# EAGLE design Xonik Waveshaper v2.3 (EAGLE 9.6.2)
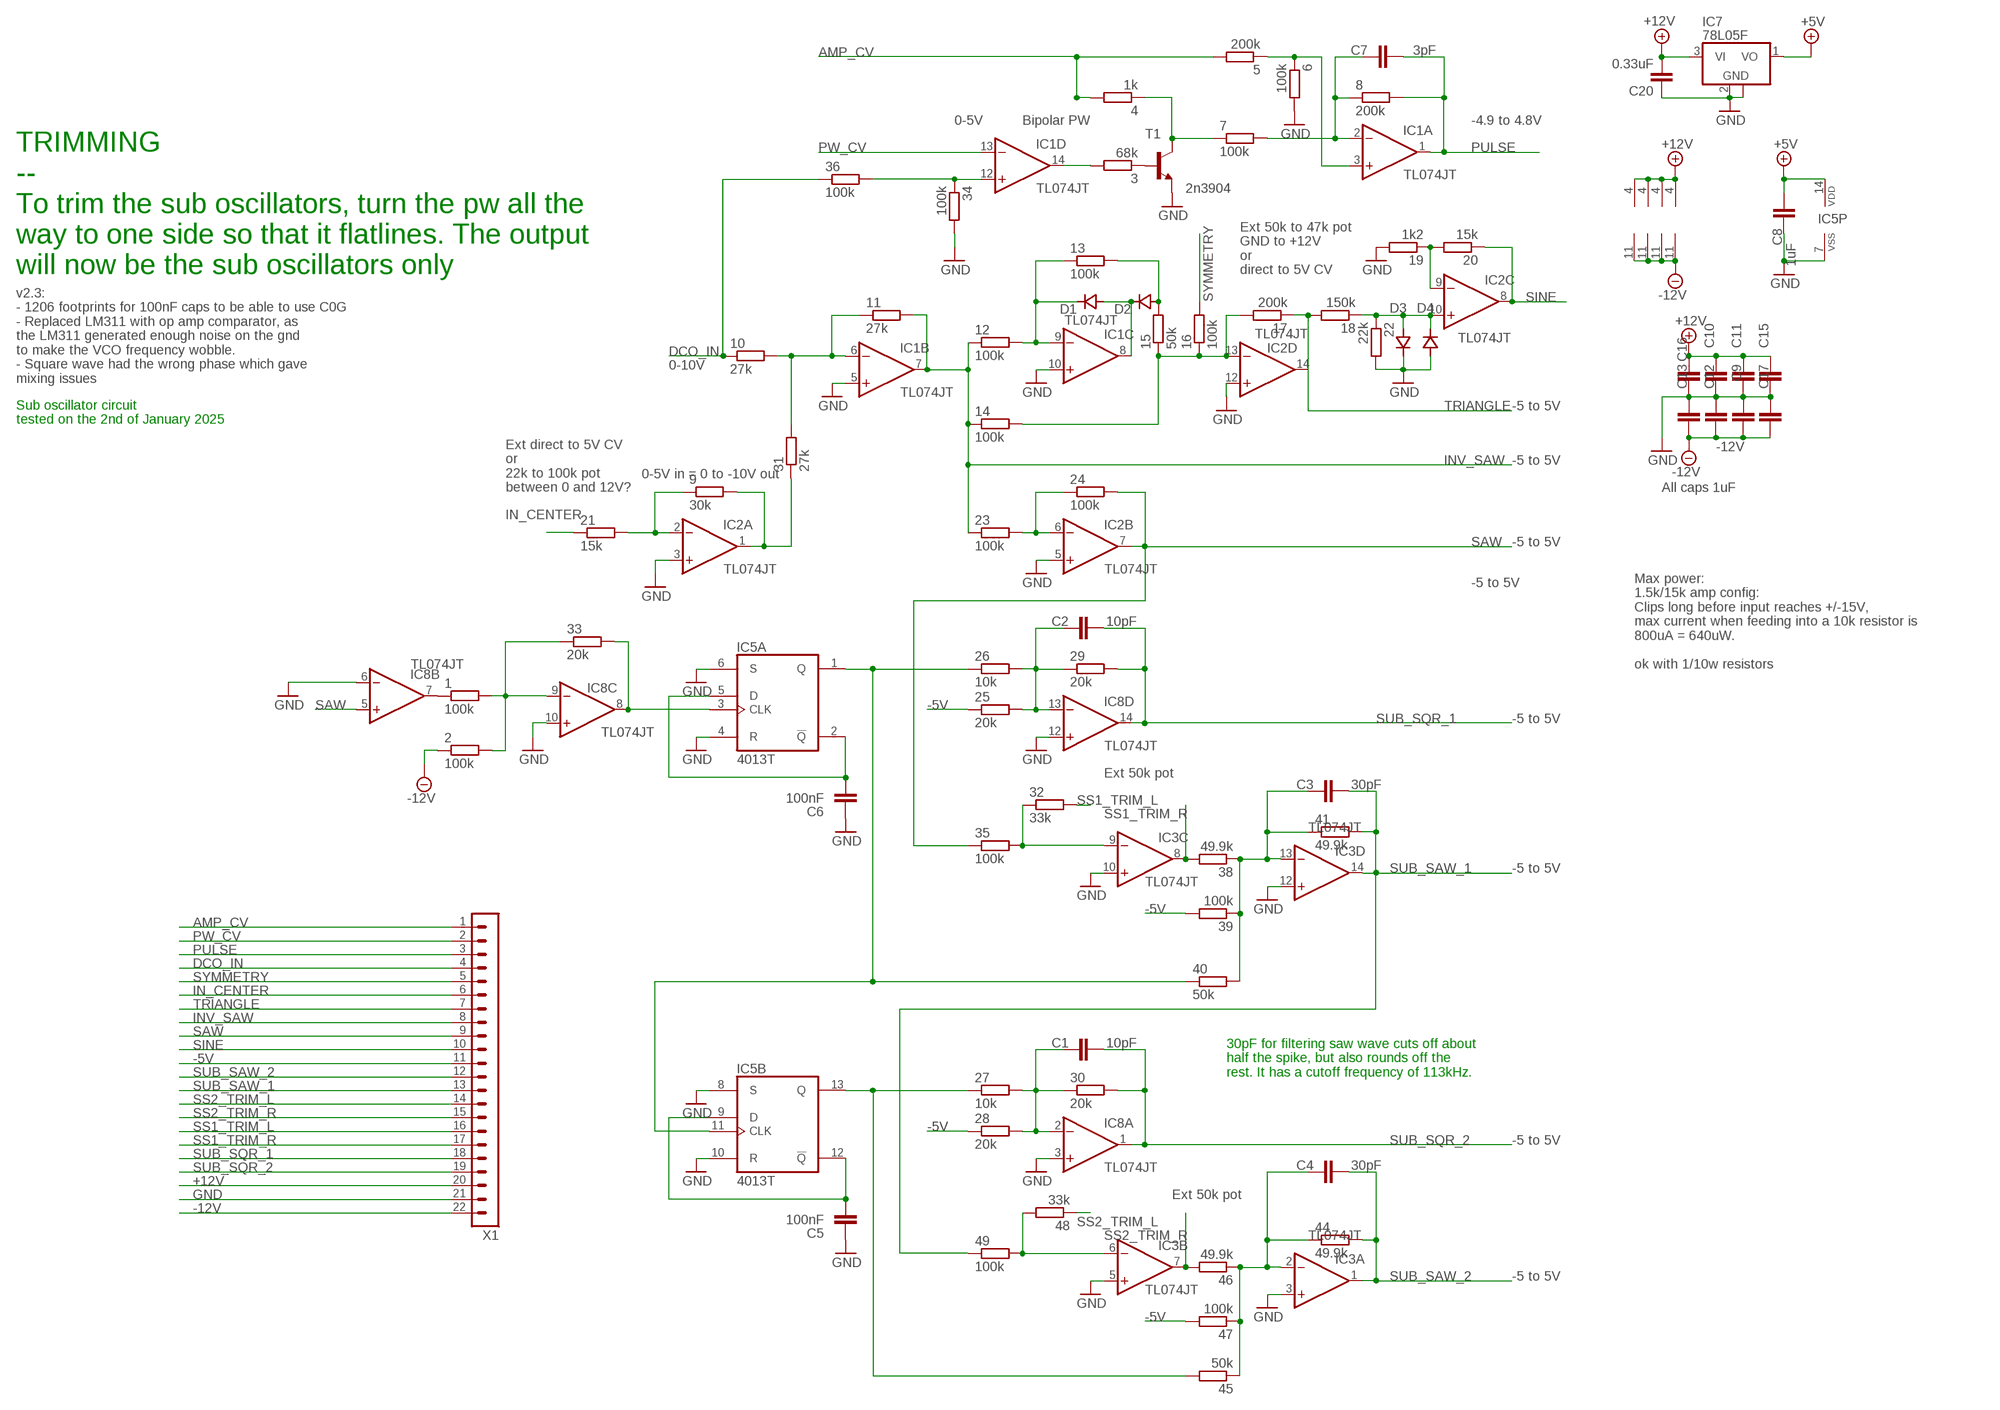
[diagram p0: schematic, sheet 1]

## Parts
1  100k  R-EU_R0603  [R0603]
2  100k  R-EU_R0603  [R0603]
3  68k  R-EU_R0603  [R0603]
4  1k  R-EU_R0603  [R0603]
5  200k  R-EU_R0603  [R0603]
6  100k  R-EU_R0603  [R0603]
7  100k  R-EU_R0603  [R0603]
8  200k  R-EU_R0603  [R0603]
9  30k  R-EU_R0603  [R0603]
10  27k  R-EU_R0603  [R0603]
11  27k  R-EU_R0603  [R0603]
12  100k  R-EU_R0603  [R0603]
13  100k  R-EU_R0402  [R0402]
14  100k  R-EU_R0603  [R0603]
15  50k  R-EU_R0603  [R0603]
16  100k  R-EU_R0603  [R0603]
17  200k  R-EU_R0603  [R0603]
18  150k  R-EU_R0603  [R0603]
19  1k2  R-EU_R0603  [R0603]
20  15k  R-EU_R0603  [R0603]
21  15k  R-EU_R0603  [R0603]
22  22k  R-EU_R0603  [R0603]
23  100k  R-EU_R0603  [R0603]
24  100k  R-EU_R0402  [R0402]
25  20k  R-EU_R0603  [R0603]
26  10k  R-EU_R0603  [R0603]
27  10k  R-EU_R0603  [R0603]
28  20k  R-EU_R0603  [R0603]
29  20k  R-EU_R0603  [R0603]
30  20k  R-EU_R0603  [R0603]
31  27k  R-EU_R0603  [R0603]
32  33k  R-EU_R0603  [R0603]
33  20k  R-EU_R0603  [R0603]
34  100k  R-EU_R0402  [R0402]
35  100k  R-EU_R0603  [R0603]
36  100k  R-EU_R0402  [R0402]
38  49.9k  R-EU_R0603  [R0603]
39  100k  R-EU_R0603  [R0603]
40  50k  R-EU_R0603  [R0603]
41  49.9k  R-EU_R0603  [R0603]
44  49.9k  R-EU_R0603  [R0603]
45  50k  R-EU_R0603  [R0603]
46  49.9k  R-EU_R0603  [R0603]
47  100k  R-EU_R0603  [R0603]
48  33k  R-EU_R0603  [R0603]
49  100k  R-EU_R0603  [R0603]
C1  10pF  C-EU-J0603  [C0603-J]
C2  10pF  C-EU-J0603  [C0603-J]
C3  30pF  C-EU-J0603  [C0603-J]
C4  30pF  C-EU-J0603  [C0603-J]
C5  100nF  C-EUC1206  [C1206]
C6  100nF  C-EUC1206  [C1206]
C7  3pF  C-EU-J0603  [C0603-J]
C8  1uF  C-EU-J0402  [C0402-J]
C9  1uF  C-EU-J0402  [C0402-J]
C10  1uF  C-EU-J0402  [C0402-J]
C11  1uF  C-EU-J0402  [C0402-J]
C12  1uF  C-EU-J0402  [C0402-J]
C13  1uF  C-EU-J0402  [C0402-J]
C15  1uF  C-EU-J0402  [C0402-J]
C16  1uF  C-EU-J0402  [C0402-J]
C17  1uF  C-EU-J0402  [C0402-J]
C20  0.33uF  C-EU-J0603  [C0603-J]
D1  1N41480805  [D0805-J]
D2  1N41480805  [D0805-J]
D3  1N41480805  [D0805-J]
D4  1N41480805  [D0805-J]
IC1  TL074JT  [TSSOP14J]
IC2  TL074JT  [TSSOP14J]
IC3  TL074JT  [TSSOP14J]
IC5  4013T  [TSSOP14J]
IC7  78L05F  [SOT89]
IC8  TL074JT  [TSSOP14J]
T1  2n3904  MMBT3904LT1-NPN-SOT23-BEC  [SOT23-BEC]
X1  MA22-1JN  [MA22N-1J]

## Nets
+5V: C8.2 IC5.14(P:VDD) IC7.1(VO)
+12V: C10.2 C11.2 C15.2 C16.2 C20.2 IC1.4(P:V+) IC2.4(P:V+) IC3.4(P:V+) IC7.3(VI) IC8.4(P:V+) X1.20
-5V: 25.1 28.1 39.2 47.2 X1.11
-12V: 2.1 C9.1 C12.1 C13.1 C17.1 IC1.11(P:V-) IC2.11(P:V-) IC3.11(P:V-) IC8.11(P:V-) X1.22
AMP_CV: 4.2 5.2 X1.1
DCO_IN: 10.1 36.1 X1.4
GND: 6.2 19.2 22.2 34.2 C5.1 C6.1 C8.1 C9.2 C10.1 C11.1 C12.2 C13.2 C15.1 C16.1 C17.2 C20.1 D3.C D4.A IC1.5(B:+IN) IC1.10(C:+IN) IC2.3(A:+IN) IC2.5(B:+IN) IC2.12(D:+IN) IC3.3(A:+IN) IC3.5(B:+IN) IC3.10(C:+IN) IC3.12(D:+IN) IC5.4(A:R) IC5.6(A:S) IC5.7(P:VSS) IC5.8(B:S) IC5.10(B:R) IC7.2(GND) IC7.2@1(GND) IC8.3(A:+IN) IC8.6(B:-IN) IC8.10(C:+IN) IC8.12(D:+IN) T1.E X1.21
IN_CENTER: 21.1 X1.6
INV_SAW: 11.2 12.1 14.1 23.1 IC1.7(B:OUT) X1.8
N$1: 9.1 21.2 IC2.2(A:-IN)
N$2: 3.2 IC1.14(D:OUT)
N$3: 3.1 T1.B
N$4: 4.1 7.1 T1.C
N$5: 5.1 6.1 IC1.3(A:+IN)
N$6: 7.2 8.1 C7.1 IC1.2(A:-IN)
N$7: 1.1 IC8.7(B:OUT)
N$8: 34.1 36.2 IC1.12(D:+IN)
N$9: 1.2 2.2 33.1 IC8.9(C:-IN)
N$10: 10.2 11.1 31.2 IC1.6(B:-IN)
N$11: 12.2 13.1 D1.C IC1.9(C:-IN)
N$12: D1.A D2.C IC1.8(C:OUT)
N$13: 13.2 15.2 D2.A
N$14: 14.2 15.1 16.1 17.2 IC2.13(D:-IN)
N$15: 23.2 24.1 IC2.6(B:-IN)
N$17: 33.2 IC5.3(A:CLK) IC8.8(C:OUT)
N$19: 25.2 26.2 29.1 C2.1 IC8.13(D:-IN)
N$21: 48.2 49.2 IC3.6(B:-IN)
N$22: 27.2 28.2 30.1 C1.1 IC8.2(A:-IN)
N$24: 32.1 35.2 IC3.9(C:-IN)
N$26: 38.1 39.1 40.2 41.1 C3.1 IC3.13(D:-IN)
N$29: 44.1 45.1 46.1 47.1 C4.1 IC3.2(A:-IN)
N$31: C6.2 IC5.2(A:!Q) IC5.5(A:D)
N$32: 26.1 40.1 IC5.1(A:Q) IC5.11(B:CLK)
N$34: C5.2 IC5.9(B:D) IC5.12(B:!Q)
N$35: 27.1 45.2 IC5.13(B:Q)
N$36: 19.1 20.2 IC2.9(C:-IN)
N$39: 18.1 22.1 D3.A D4.C IC2.10(C:+IN)
N$42: 9.2 31.1 IC2.1(A:OUT)
PULSE: 8.2 C7.2 IC1.1(A:OUT) X1.3
PW_CV: IC1.13(D:-IN) X1.2
SAW: 24.2 35.1 IC2.7(B:OUT) IC8.5(B:+IN) X1.9
SINE: 20.1 IC2.8(C:OUT) X1.10
SS1_TRIM_L: 32.2 X1.16
SS1_TRIM_R: 38.2 IC3.8(C:OUT) X1.17
SS2_TRIM_L: 48.1 X1.14
SS2_TRIM_R: 46.2 IC3.7(B:OUT) X1.15
SUB_SAW_1: 41.2 49.1 C3.2 IC3.14(D:OUT) X1.13
SUB_SAW_2: 44.2 C4.2 IC3.1(A:OUT) X1.12
SUB_SQR_1: 29.2 C2.2 IC8.14(D:OUT) X1.18
SUB_SQR_2: 30.2 C1.2 IC8.1(A:OUT) X1.19
SYMMETRY: 16.2 X1.5
TRIANGLE: 17.1 18.2 IC2.14(D:OUT) X1.7

## Notes on the sheet
- 0-5V | Bipolar PW | -4.9 to 4.8V
- TRIMMING
  --
  To trim the sub oscillators, turn the pw all the 
  way to one side so that it flatlines. The output 
  will now be the sub oscillators only
- Ext 50k to 47k pot 
  GND to +12V
  or
  direct to 5V CV
- 0-10V
- v2.3:
  - 1206 footprints for 100nF caps to be able to use C0G
  - Replaced LM311 with op amp comparator, as 
  the LM311 generated enough noise on the gnd
  to make the VCO frequency wobble.
  - Square wave had the wrong phase which gave
  mixing issues
- -5 to 5V
- Sub oscillator circuit
  tested on the 2nd of January 2025
- -5 to 5V
- 0-5V in = 0 to -10V out
- Ext direct to 5V CV
  or 
  22k to 100k pot
  between 0 and 12V?
- All caps 1uF
- -5 to 5V
- -5 to 5V
- Max power:
  1.5k/15k amp config:
  Clips long before input reaches +/-15V,
  max current when feeding into a 10k resistor is
  800uA = 640uW. 
  
  ok with 1/10w resistors
- -5 to 5V
- Ext 50k pot
- -5 to 5V
- 30pF for filtering saw wave cuts off about
  half the spike, but also rounds off the
  rest. It has a cutoff frequency of 113kHz.
- -5 to 5V
- Ext 50k pot
- -5 to 5V

## Library data of the parts
1-36 38-41 44-49 = rcl:R-EU_: RESISTOR, European symbol; SPICEPREFIX: R
C1-C4 C7-C13 C15-C17 C20 = joakim:C-EU-J: CAPACITOR, European symbol
C5 C6 = rcl:C-EU: CAPACITOR, European symbol; SPICEPREFIX: C
D1-D4 = joakim:1N4148: DIODE high speed (Philips)
IC1-IC3 IC8 = joakim:TL074J: OP AMP
IC5 = joakim:4013: Dual D FLIP FLOP, set/reset
IC7 = linear:78L*: POSITOIV-VOLTAGE REGULATORS Output up to 100 mA Source: Datasheet <http://focus.ti.com/lit/ds/symlink/ua78l05.pdf>
T1 = transistor-neu-to92:*-NPN-: NPN Transistror
X1 = joakim:MA22-1J: PIN HEADER

## Board
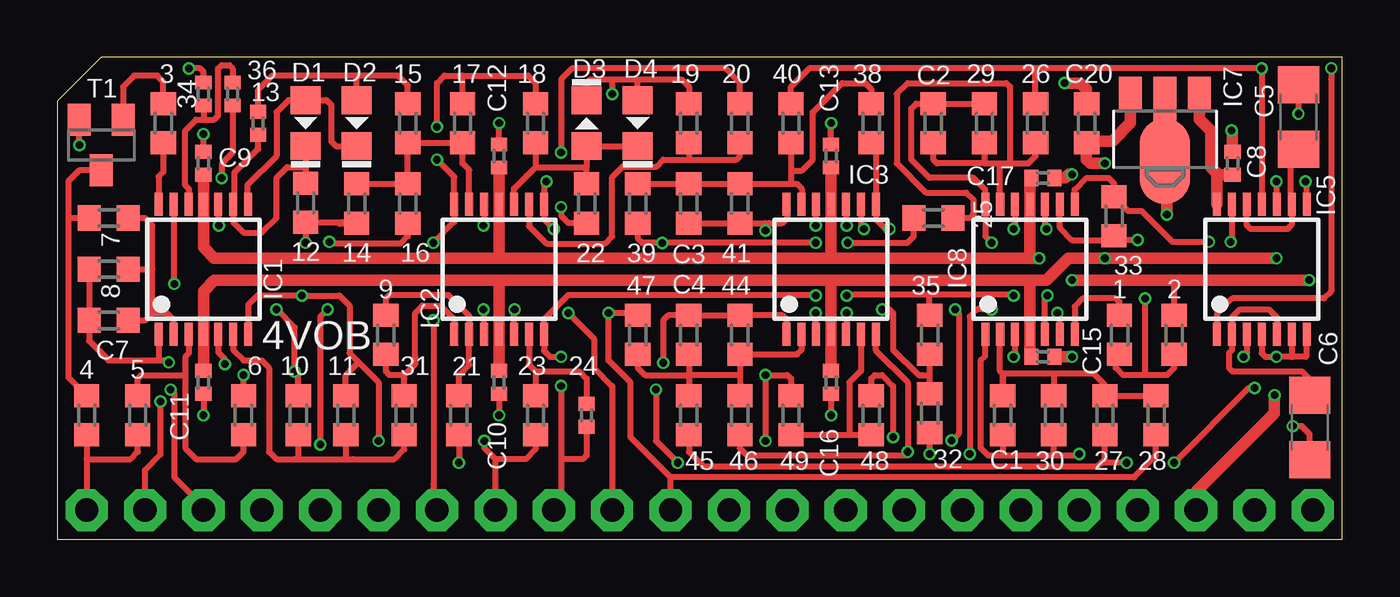
[diagram p1: board, top side]
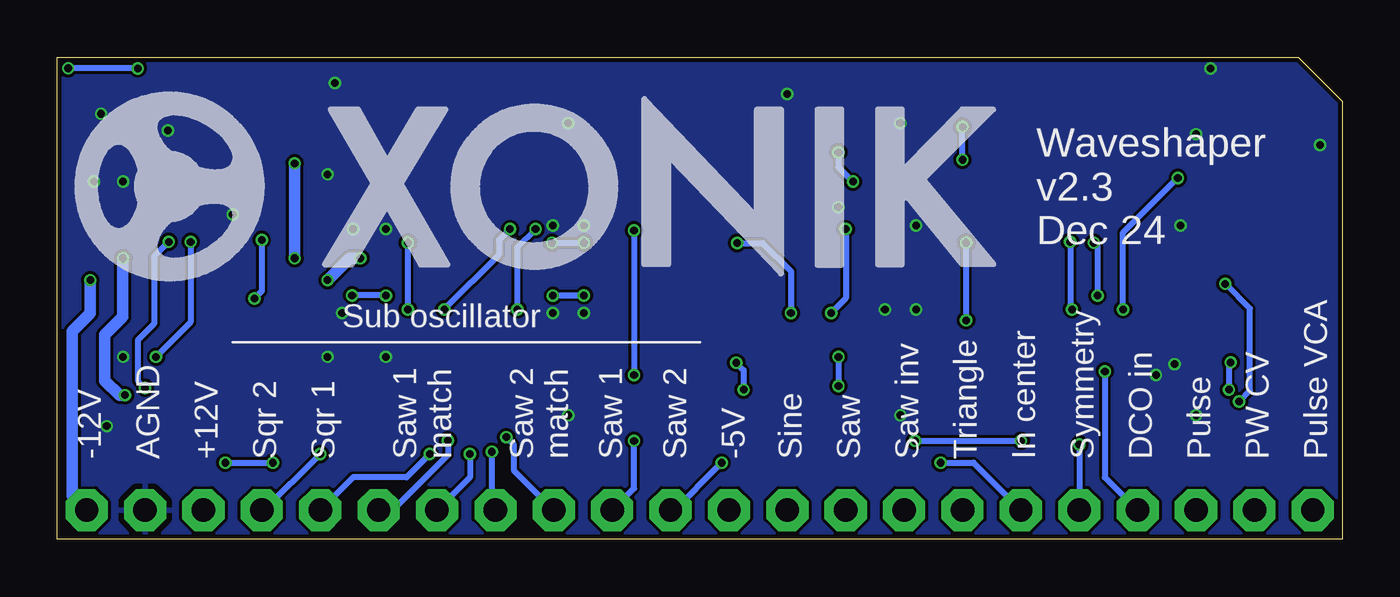
[diagram p2: board, bottom side, seen from below]

Size 55.88 x 20.95 mm. Coordinates in mm from the lower left corner, seen from the top.
Outline: 0,0 55.88,0 55.88,20.95 1.91,20.95 0,19.05 0,0
Copper layers (1*16): Top 0.035mm / dielectric 1.6mm / Bottom 0.035mm
Design rules "jlcpcb-2layers *": minimum track width 5mil, minimum drill 0.3mm, track to track 5mil, track to pad 5mil, pad to pad 5mil, via to via 5mil, smd to smd 5mil, copper to edge 0.2mm, drill to drill 6mil, minimum pad ring 10mil, minimum via ring 4mil, stop-mask expansion 4mil, vias tented up to drill 0mil, thermal gap 10mil

### Footprints (pad centres in the part's own frame; a part is rotated, then mirrored left to right if it is on the bottom)
R0603 = smd 1 x 1.1: 1 -0.85,0; 2 0.85,0
R0402 = smd 0.6 x 0.7: 1 -0.5,0; 2 0.5,0
C0603-J = smd 1 x 1.1: 1 -0.85,0; 2 0.85,0
C1206 = smd 1.6 x 1.8: 1 -1.4,0; 2 1.4,0
C0402-J = smd 0.6 x 0.7: 1 -0.5,0; 2 0.5,0
D0805-J = smd 1.2 x 1.3: A 1,0; C -1,0
TSSOP14J = smd 0.35 x 1: 1 -1.95,-2.825; 2 -1.3,-2.825; 3 -0.65,-2.825; 4 0,-2.825; 5 0.65,-2.825; 6 1.3,-2.825; 7 1.95,-2.825; 8 1.95,2.825; 9 1.3,2.825; 10 0.65,2.825; 11 0,2.825; 12 -0.65,2.825; 13 -1.3,2.825; 14 -1.95,2.825
SOT89 = smd 1 x 1.5: 1 -1.499,-1.981; 3 1.499,-1.981 | smd 1 x 2: 2 0,-1.727 | smd 2.2 x 3.7: 2@1 0,0.94
SOT23-BEC = smd 1 x 1.4: B -0.95,-1.1; C 0,1.1; E 0.95,-1.1
MA22N-1J = drill 1.016 octagon: 1 -26.67,0; 2 -24.13,0; 3 -21.59,0; 4 -19.05,0; 5 -16.51,0; 6 -13.97,0; 7 -11.43,0; 8 -8.89,0; 9 -6.35,0; 10 -3.81,0; 11 -1.27,0; 12 1.27,0; 13 3.81,0; 14 6.35,0; 15 8.89,0; 16 11.43,0; 17 13.97,0; 18 16.51,0; 19 19.05,0; 20 21.59,0; 21 24.13,0; 22 26.67,0

### Placement (x,y rotation side)
1  46.2,8.89 270 top
2  48.58,8.89 270 top
3  4.6,18.1 270 top
4  1.27,5.4 270 top
5  3.49,5.4 270 top
6  8.1,5.4 90 top
7  2.22,13.97 0 top
8  2.22,11.75 180 top
9  14.29,8.89 270 top
10  10.48,5.4 270 top
11  12.54,5.4 90 top
12  10.79,14.64 90 top
13  8.73,18.1 90 top
14  13.02,14.61 90 top
15  15.24,18.1 90 top
16  15.24,14.61 270 top
17  17.62,18.1 270 top
18  20.8,18.1 90 top
19  27.46,18.1 90 top
20  29.69,18.1 270 top
21  17.46,5.4 90 top
22  23.02,14.61 270 top
23  20.8,5.4 90 top
24  23.02,5.4 270 top
25  38.1,13.97 0 top
26  42.55,18.1 270 top
27  45.56,5.4 90 top
28  47.78,5.4 90 top
29  40.32,18.1 90 top
30  43.34,5.4 270 top
31  15.08,5.4 270 top
32  37.94,5.48 270 top
33  45.96,14.05 90 top
34  6.35,19.37 90 top
35  37.94,8.89 270 top
36  7.62,19.37 90 top
38  35.4,18.1 270 top
39  25.24,14.61 270 top
40  31.91,18.1 270 top
41  29.69,14.61 270 top
44  29.69,8.89 90 top
45  27.46,5.4 270 top
46  29.69,5.4 270 top
47  25.24,8.89 90 top
48  35.4,5.4 270 top
49  31.91,5.4 270 top
C1  41.12,5.4 270 top
C2  38.1,18.1 90 top
C3  27.46,14.61 270 top
C4  27.46,8.89 90 top
C5  53.98,18.36 270 top
C6  54.48,4.86 90 top
C7  2.22,9.53 180 top
C8  51.12,16.35 270 top
C9  6.35,16.35 90 top
C10  19.21,6.83 90 top
C11  6.35,6.83 90 top
C12  19.21,16.67 90 top
C13  33.66,16.67 90 top
C15  42.86,7.94 180 top
C16  33.66,6.83 90 top
C17  42.86,15.72 0 top
C20  44.77,18.1 270 top
D1  10.79,18.1 90 top
D2  13.02,18.1 90 top
D3  23.02,18.1 270 top
D4  25.24,18.1 90 top
IC1  6.35,11.75 0 top
IC2  19.21,11.75 0 top
IC3  33.66,11.75 0 top
IC5  52.39,11.75 0 top
IC7  48.18,17.38 180 top
IC8  42.31,11.75 0 top
T1  1.91,17.14 180 top
U$1  [XONIK_LOGO_40]  55.09,11.27 0 bottom
X1  27.94,1.27 0 top

### Tracks (layer width: path | path; a pad name or v marks a point on that pad's centre or on a via)
+5V
  Top 0.508: IC7.1 49.68,18.27 50.16,17.78 50.16,16.19 50.51,15.85 | 50.51,15.85 C8.2 | IC5.14 50.44,15.78 50.51,15.85
+12V  (via drill 0.33)
  Top 0.508: 19.21,11.27 6.83,11.27 6.35,10.79 IC1.4 C11.2 | 19.21,11.27 33.66,11.27 | 33.66,11.27 42.39,11.27 | 42.39,11.27 43.02,11.27 43.97,12.22 v45.56,12.22 v53.02,12.22 | 19.21,11.27 IC2.4 C10.2 | 33.66,11.27 IC3.4 C16.2 | v52.94,6.27 52.94,5.48 49.53,2.06 X1.20 | 42.39,11.27 42.31,11.19 IC8.4 42.31,7.99 C15.2 | v45.56,16.35 44.93,16.35 44.77,16.51 C20.2 44.82,17.3 45.88,17.3 46.68,18.11 IC7.3
  Bottom 0.508: v53.02,12.22 53.03,12.21 53.03,9.67 53.82,8.89 53.82,6.91 53.18,6.27 v52.94,6.27 | v45.56,16.35 v45.56,12.22
-5V  (via drill 0.33)
  Top 0.254: 25.4,9.58 47.2 25.14,9.84 v23.97,9.84 23.97,7.78 24.92,6.83 24.92,4.45 26.67,2.7 | 39.2 25.24,13.1 25.44,12.9 v26.31,12.9 | v26.31,12.9 v26.31,12.89 | 28.1 47.78,3.65 46.83,2.7 26.67,2.7 | v32.98,12.9 v26.31,12.9 | 25.1 37.25,13.18 36.97,12.9 v34.37,12.9 | X1.11 26.67,2.7
  Bottom 0.254: v26.31,12.89 25.2,12.89 23.97,11.65 v23.97,9.84 | v34.37,12.9 v32.98,12.9
-12V  (via drill 0.33)
  Top 0.254: 2.1 48.58,11.11 48.74,11.27
  Top 0.508: v42.7,12.22 42.23,12.22 | 42.23,12.22 33.66,12.22 | 33.66,12.22 19.21,12.22 | 19.21,12.22 6.83,12.22 6.35,12.7 IC1.11 C9.1 | 19.21,12.22 IC2.11 C12.1 | 33.66,12.22 IC3.11 C13.1 | 49.37,11.27 v54.45,11.27 | 49.37,11.27 48.74,11.27 v44.13,11.27 44.16,11.25 | 49.4,11.27 49.37,11.27 | 42.23,12.22 42.31,12.3 IC8.11 42.31,15.66 C17.1
  Bottom 0.508: v44.13,11.27 43.18,12.22 v42.7,12.22 | v54.45,11.27 54.45,9.84 55.24,9.05 55.24,1.91 X1.22
AMP_CV
  Top 0.254: 4.2 1.27,3.49 | 1.27,3.49 X1.1 | 1.27,3.49 3.17,3.49 3.49,3.81 5.2
DCO_IN  (via drill 0.33)
  Top 0.254: 36.1 7.62,16.8 7.14,16.33 v7.14,15.72 | 10.1 10.48,7.14 v10.32,7.3 10.32,9.21 v9.53,10
  Bottom 0.254: v10.32,7.3 10.32,2.7 X1.4 | v9.53,10 9.53,13.34 v7.14,15.72
GND  (via drill 0.33)
  Top 0.254: C11.1 v6.35,5.4 | v0.95,17.14 T1.E | C9.2 v6.35,17.62 | v18.53,13.65 18.56,13.68 IC2.12 | C12.2 v19.21,18.1 | D3.C 23.02,19.84 23.18,20 24.13,20 | 24.13,20 25.24,20 | 25.24,20 27.15,20 27.46,19.68 19.2 | D4.A 25.24,20 | 24.13,20 v24.13,19.37 | C5.1 v53.98,18.51 | IC5.8 54.34,15.51 v54.29,15.56 | IC5.10 53.04,15.54 v53.02,15.56 | C16.1 v33.66,5.4 | C13.2 v33.66,18.1 | C10.1 v19.21,5.4 | v21.91,14.45 21.91,14.07 22.23,13.76 22.2 | IC1.10 7,13.68 v7.03,13.65 | IC1.5 7,8.13 7.29,7.84 v7.29,7.62 | IC2.3 18.56,9.98 v18.53,10 | v19.88,10 19.84,9.96 19.84,8.94 IC2.5 | IC3.10 34.3,13.68 v34.33,13.65 | IC3.12 32.98,14.55 v32.98,13.65 | IC3.3 33.01,9.82 v32.98,9.84 | IC3.5 34.33,8.95 v34.33,9.84 | IC5.6 53.69,7.97 | 53.69,7.97 53.72,7.94 54.29,7.94 54.34,7.98 IC5.7 | C6.1 54.48,4.58 54.13,4.92 v53.74,4.92 | 6.2 v8.1,7.14 | 34.2 6.35,20.34 6.21,20.48 v5.71,20.48 | IC8.3 41.66,8 v41.59,7.94 | IC8.6 43.61,9.73 v43.5,9.84 | IC8.12 41.66,13.56 v41.59,13.49 | IC8.10 42.96,13.56 v43.02,13.49 | 53.69,7.97 53.66,7.94 v53.02,7.94 52.55,7.94 52.39,8.1 IC5.4
  Top 0.508: v44.13,15.88 44,15.88 43.84,15.72 C17.2 | C15.1 v44.13,7.94 | v51.07,17.78 51.12,17.74 C8.1 | C20.1 44.77,19.58 44.51,19.84 v43.81,19.84 | IC7.2@1 48.26,16.36 | 48.26,16.36 v48.26,14.13 | IC7.2 48.26,19.03 48.26,16.36
  pour Bottom: -0.83,22.35 57.4,22.35 57.4,-1.08 0.44,-1.08 -0.83,0.19
IN_CENTER  (via drill 0.33)
  Top 0.254: 17.46,4.76 21.1 v17.46,3.33
  Bottom 0.254: v17.46,3.33 16.03,3.33 X1.6
INV_SAW  (via drill 0.33)
  Top 0.254: 14.1 12.36,13.76 12.29,13.72 12.37,13.79 12.1 10.79,13.02 v10.79,12.9 | 23.1 20.8,3.91 20.38,3.49 19.05,3.49 | 19.05,3.49 18.57,3.97 v18.57,4.29 | IC1.7 8.3,10.21 8.69,10.6 v10.64,10.6 12.26,10.6 12.7,10.16 12.7,8.1 13.1,7.7 | X1.8 19.05,3.49 | 13.1,7.7 13.97,6.83 v13.97,4.29 | 11.2 12.54,7.14 13.1,7.7
  Bottom 0.254: v10.79,12.9 10.64,12.74 v10.64,10.6 | v18.57,4.29 v13.97,4.29
N$1
  Top 0.254: 9.1 14.29,10.48 14.45,10.64 15.24,10.64 16.99,10.64 17.91,9.71 IC2.2 17.91,7.59 17.46,7.14 21.2
N$2
  Top 0.254: 3.2 4.6,15.98 4.4,15.77 IC1.14
N$3
  Top 0.254: 3.1 4.6,19.9 4.34,20.16 3.33,20.16 3.33,20.15 2.85,19.67 T1.B
N$4
  Top 0.254: 0.48,13.97 0.48,15.57 0.95,16.05 T1.C | 0.48,13.97 0.48,7.04 4.1 | 7.1 0.48,13.97
N$5
  Top 0.254: IC1.3 5.71,8.91 5.71,8.1 5.56,7.94 5.56,7.46 | 5.56,7.46 5.56,7.14 3.65,7.14 3.49,6.99 5.1 | 5.56,7.46 5.56,7.3 5.56,3.97 6.03,3.49 7.78,3.49 8.1,3.81 6.1
N$6
  Top 0.254: C7.1 3.81,9.53 4.13,9.84 | 7.2 3.81,13.97 4.13,13.65 4.13,11.75 | 4.13,9.84 4.13,11.75 | 8.1 4.13,11.75 | IC1.2 5.05,9.55 4.76,9.84 4.13,9.84
N$7
  Top 0.254: 1.1 46.2,10.32 46.04,10.48 44.61,10.48 44.26,10.13 IC8.7
N$8
  Top 0.254: 6.35,18.26 6.03,18.26 5.56,17.78 5.56,15.4 5.71,15.24 5.71,14.59 IC1.12 | 6.35,18.26 6.83,18.26 6.99,18.41 6.99,20.47 7.14,20.63 7.47,20.63 7.62,20.48 36.2 | 34.1 6.35,18.26
N$9  (via drill 0.33)
  Top 0.254: IC8.9 43.61,13.54 44.13,13.02 45.78,13.02 45.86,13.1 | 45.86,13.1 45.86,13.04 | v46.99,13.02 45.94,13.02 | 45.94,13.02 45.86,13.1 | 2.2 48.58,7.46 48.26,7.14 47.31,7.14 | v47.31,10.48 47.31,7.14 | 47.31,7.14 46.35,7.14 46.04,7.46 46.04,7.88 1.2 | 33.1 45.96,13.04 45.94,13.02
  Bottom 0.254: v46.99,13.02 46.99,10.79 v47.31,10.48
N$10
  Top 0.254: 10.48,3.49 10.32,3.49 9.53,3.49 9.21,3.81 9.21,7.46 8.89,7.78 8.1,7.78 7.65,8.22 IC1.6 | 10.48,3.49 12.54,3.49 | 12.54,3.49 14.66,3.49 15.08,3.91 31.2 | 12.54,3.49 12.86,3.49 | 10.2 10.48,3.49 | 11.1 12.54,3.49
N$11
  Top 0.254: 13.1 8.73,16.99 7.69,15.95 7.69,14.61 IC1.9 7.65,13.78 8.1,13.34 8.89,13.34 9.53,13.97 9.53,15.72 10,16.19 10.48,16.19 10.79,16.19 | D1.C 10.79,16.19 | 10.79,16.19 12.2
N$12
  Top 0.254: D2.C 12.11,17.1 11.91,17.3 11.91,18.89 11.7,19.1 D1.A 10.05,19.1 9.53,18.57 9.53,16.67 8.26,15.4 8.26,14.62 IC1.8
N$13
  Top 0.254: 13.02,20.16 13.18,20.16 14.82,20.16 15.24,19.74 15.2 | 13.02,20.16 9.34,20.16 8.73,19.55 13.2 | D2.A 13.02,20.16
N$14
  Top 0.254: IC2.13 17.91,16.06 17.62,16.35 17.2 | 17.94,16.93 17.2 | 14.2 16.1 15.1 17.2
N$15
  Top 0.254: IC2.6 20.51,7.59 20.8,7.3 | 20.8,7.3 23.2 | 24.1 23.02,6.99 22.7,7.3 20.8,7.3
N$17  (via drill 0.33)
  Top 0.254: IC8.8 44.26,15.21 44.77,15.72 45.72,15.72 45.96,15.48 33.2 46.57,14.29 47.15,14.29 48.5,12.94 v50.09,12.94 | v51.59,7.94 51.75,8.1 51.75,8.91 IC5.3
  Bottom 0.254: v50.09,12.94 50.09,9.45 v51.59,7.94
N$19
  Top 0.254: 29.1 40.32,16.35 | 40.32,16.35 40.96,16.35 | 40.96,16.35 41.43,16.35 | 41.43,16.35 42.23,16.35 42.55,16.67 26.2 | 41.43,16.35 41.43,19.68 41.27,19.84 36.99,19.84 36.51,19.37 36.51,16.35 37.78,15.08 39.53,15.08 39.85,14.76 39.85,14.13 39.69,13.97 25.2 | IC8.13 41.01,16.3 40.96,16.35 | C2.1 38.1,16.51 38.26,16.35 40.32,16.35
N$21
  Top 0.254: IC3.6 34.95,7.33 34.77,7.14 34.45,6.83 34.45,4.55 | 49.2 34.45,4.55 | 34.45,4.55 48.2
N$22
  Top 0.254: 41.17,6.3 C1.1 | 43.34,7.2 30.1 | 43.34,7.2 41.12,7.2 | C1.1 41.12,7.2 | 43.34,7.2 45.09,7.2 45.56,6.72 27.2 28.2 | 41.12,7.23 C1.1 | 41.12,7.2 41.01,7.31 IC8.2
N$24  (via drill 0.33)
  Top 0.254: IC3.9 34.95,13.62 v35.08,13.49 | 36.04,10 v35.88,10 36.2,10 36.35,9.84 36.35,8.26 37.47,7.14 37.62,7.14 37.94,7.14 | 37.94,8.26 37.94,8.1 | 37.94,8.1 37.94,7.14 | 37.94,7.14 32.1 | 35.2 37.94,8.1
  Bottom 0.254: v35.08,13.49 35.88,12.7 v35.88,10
N$26
  Top 0.254: 31.91,15.46 41.1 C3.1 39.1 | 31.91,15.46 32.17,15.46 32.38,15.24 32.38,14.6 IC3.13 | 40.2 31.91,16.03 | 31.91,16.03 31.91,15.46 | 31.91,16.03 32.38,16.03 32.86,16.51 32.86,18.57 34.13,19.84 35.14,19.84 35.4,19.58 38.1
N$29
  Top 0.254: IC3.2 32.38,8.89 32.38,8.26 32.17,8.04 44.1 29.69,7.14 | C4.1 27.46,7.14 | 27.46,7.14 45.1 | 29.69,7.14 46.1 | 29.69,7.14 27.46,7.14 | 47.1 25.24,7.46 25.56,7.14 27.46,7.14
N$31
  Top 0.254: IC5.5 53.04,9.67 52.7,10 51.44,10 51.12,9.68 51.12,8.95 IC5.2 51.09,8.22 50.96,8.1 50.96,7.46 51.12,7.3 54.13,7.3 54.48,6.96 C6.2
N$32  (via drill 0.33)
  Top 0.254: 40.1 31.91,19.68 32.7,20.48 42.55,20.48 | 42.55,20.48 v52.39,20.48 IC5.11 | IC5.1 50.44,9.8 51.12,10.48 55.09,10.48 55.4,10.79 55.4,20 55.41,20.01 v55.41,20.49 | 26.1 42.55,20.48
  Bottom 0.254: v52.39,20.48 55.4,20.48 v55.41,20.49
N$34
  Top 0.254: C5.2 53.66,16.86 53.66,14.6 IC5.9 53.69,13.68 53.5,13.49 51.91,13.49 51.74,13.67 IC5.12
N$35  (via drill 0.33)
  Top 0.254: 45.2 27.46,3.81 28.1,3.17 45.24,3.17 45.4,3.33 | IC5.13 51.09,12.99 v51.04,12.94 | v46.51,3.33 45.4,3.33 | 45.4,3.33 45.56,3.49 27.1 | v52.07,6.59 51.83,6.59 v48.58,3.33
  Bottom 0.254: v52.07,6.59 52.39,6.91 52.39,8.65 51.67,9.37 51.67,12.3 v51.04,12.94 | v48.58,3.33 v46.51,3.33
N$36
  Top 0.254: IC2.9 20.51,13.62 21.27,12.86 23.81,12.86 24.13,13.18 24.13,15.75 24.59,16.21 26.05,16.21 26.35,16.51 27.46,16.51 | 20.2 29.69,16.67 29.53,16.51 27.46,16.51 | 19.1 27.46,16.51
N$39
  Top 0.254: IC2.10 19.86,15.26 20.4,15.8 20.8,16.19 | 18.1 20.8,16.19 | 20.8,16.19 23.02,16.19 | 23.02,16.19 D3.A D4.C | 22.1 23.02,16.19
N$42
  Top 0.254: 15.56,7.78 15.56,7.94 | 15.56,7.94 15.56,9.84 15.88,10.16 16.67,10.16 17.26,9.57 IC2.1 | 31.1 15.08,6.99 15.08,7.14 | 15.08,7.14 14.45,7.14 14.29,7.3 9.2 | 15.56,7.94 15.56,7.62 15.08,7.14
PULSE  (via drill 0.33)
  Top 0.254: 8.2 C7.2 1.37,8.63 2.22,7.78 4.45,7.78 | v4.84,7.7 4.84,7.78 4.45,7.78 | 4.45,8.88 IC1.1 4.4,7.82 4.45,7.78 | X1.3 6.35,1.43 5.08,2.7 5.08,6.35 v4.92,6.51
  Bottom 0.254: v4.84,7.7 4.92,7.62 v4.92,6.51
PW_CV  (via drill 0.33)
  Top 0.254: v5.08,11.11 5.05,11.11 IC1.13 | v4.48,6 4.48,3.68 3.81,3.02 X1.2
  Bottom 0.254: v4.48,6 4,6.48 4,10.03 v5.08,11.11
SAW  (via drill 0.33)
  Top 0.254: v32.98,10.61 32.98,10.64 22.23,10.64 21.16,9.57 IC2.7 21.16,8.21 21.43,7.94 v21.91,7.94 | 37.94,10.64 34.37,10.64 v34.33,10.6 | v41.59,10.6 41.55,10.64 37.94,10.64 | 35.1 37.94,10.64 | X1.9 21.91,1.59 21.91,3.49 | v21.91,6.67 21.91,3.49 | 24.2 23.02,3.65 22.86,3.49 21.91,3.49 | IC8.5 42.96,10.51 v43.06,10.61
  Bottom 0.254: v32.98,10.61 34.32,10.61 v34.33,10.6 | v41.59,10.6 41.63,10.64 43.03,10.64 v43.06,10.61 | v21.91,7.94 v21.91,6.67
SINE  (via drill 0.33)
  Top 0.254: 20.1 29.69,19.84 29.05,20.48 22.38,20.48 21.91,20 v21.91,16.83 | v21.27,15.56 21.16,15.44 IC2.8 21.16,13.93 v21.59,13.49 | v22.23,9.84 22.86,9.21 | 22.86,9.21 23.02,9.05 | 22.86,9.21 23.34,8.73 23.34,7.46 24.13,6.67 X1.10
  Bottom 0.254: v21.91,16.83 21.91,16.19 v21.27,15.56 | v21.59,13.49 21.59,10.48 v22.23,9.84
SS1_TRIM_L  (via drill 0.33)
  Top 0.254: 32.2 v37.94,3.71 | v37.94,3.71 37.94,3.69 v37.94,3.71
  Bottom 0.254: v37.94,3.71 37.94,2.7 X1.16
SS1_TRIM_R  (via drill 0.33)
  Top 0.254: 38.2 35.6,17.04 IC3.8 35.6,13.93 36.04,13.49 v36.2,13.49 | v39.05,10 39.21,9.84 39.21,4.6 38.89,4.29 v38.89,4.3
  Bottom 0.254: v36.2,13.49 36.67,13.02 36.67,12.38 v39.05,10 | v38.89,4.3 38.89,3.67 41.29,1.27 X1.17
SS2_TRIM_L  (via drill 0.33)
  Top 0.254: 48.1 35.4,6.99 35.56,7.14 35.88,7.14 36.35,6.67 v36.35,4.45
  Bottom 0.254: v36.35,4.45 36.04,4.13 36.04,3.02 X1.14
SS2_TRIM_R  (via drill 0.33)
  Top 0.254: 46.2 29.69,3.97 30,3.65 36.99,3.65 v36.99,3.81 36.99,6.83 35.6,8.21 IC3.7
  Bottom 0.254: X1.15 36.99,1.31 v36.99,3.81
SUB_SAW_1  (via drill 0.33)
  Top 0.254: C3.2 41.2 30.8,13.76 | 30.8,13.76 30.96,13.76 31.54,13.76 31.75,13.97 31.75,14.53 IC3.14 | 49.1 31.91,6.99 31.75,7.14 v30.8,7.14 v30.8,4.29 | v30.8,13.43 30.8,13.76
  Bottom 0.254: v30.8,13.43 v30.8,7.14 | X1.13 30.8,2.22 v30.8,4.29
SUB_SAW_2  (via drill 0.33)
  Top 0.254: IC3.1 31.7,9.57 31.54,9.74 44.2 C4.2 26.57,9.74 26.35,9.53 v26.35,7.68 | v26.35,7.68 26.35,7.66 v26.35,7.68 | v26.04,6.51 26.04,4.29 v26.99,3.33
  Bottom 0.254: v26.35,7.68 26.04,7.36 v26.04,6.51 | X1.12 29.18,1.14 v26.99,3.33
SUB_SQR_1  (via drill 0.33)
  Top 0.254: v40.64,10 40.01,10 39.69,9.68 v39.69,3.71 39.69,3.69 | 29.2 C2.2 37.36,18.95 37.15,18.73 37.15,16.51 37.94,15.72 39.85,15.72 40.36,15.21 IC8.14 40.36,13.18 v40.64,12.9
  Bottom 0.254: v40.64,12.9 v40.64,10 | v39.69,3.71 40.7,2.7 43.03,2.7 43.04,2.68 X1.18
SUB_SQR_2  (via drill 0.33)
  Top 0.254: 43.34,3.65 30.2 | 41.12,3.65 40.48,3.65 40.16,3.97 40.16,7.78 40.36,7.97 IC8.1 | 41.12,3.65 43.34,3.65 | C1.2 41.12,3.65 | 43.34,3.65 44.45,3.65 v44.45,3.71
  Bottom 0.254: X1.19 46.97,1.19 v44.45,3.71
SYMMETRY  (via drill 0.33)
  Top 0.254: 16.2 15.24,13.18 14.92,12.86 11.91,12.86 v11.83,12.94 | v11.75,10 11.43,9.68 v11.43,4.13
  Bottom 0.254: v11.83,12.94 11.83,10.08 v11.75,10 | v11.43,4.13 X1.5
TRIANGLE  (via drill 0.33)
  Top 0.254: v16.51,16.51 17.26,15.76 IC2.14 17.26,13.81 v16.35,12.9 | v16.51,17.94 16.51,19.84 16.83,20.16 17.62,20.16 | 17.62,20.16 20.48,20.16 20.8,19.84 18.2 | 17.1 17.62,20 17.62,20.16 | v16.35,9.53 16.35,2.38 | 16.35,2.38 16.35,2.22 | 16.35,2.38 16.35,1.31 X1.7
  Bottom 0.254: v16.51,16.51 v16.51,17.94 | v16.35,12.9 v16.35,9.53

### Text on the board
tNames: 4VOB
bNames: Waveshaper / v2.3 / Dec 24 | Sub oscillator | Pulse VCA | PW CV | Pulse | DCO in | Symmetry | In center | Triangle | Saw inv | Saw | Sine | -5V | Saw 2 | Saw 1 | Saw 2 / match | Saw 1 / match | Sqr 1 | Sqr 2 | +12V | AGND | -12V